# EAGLE design lab4 (EAGLE 9.6.2)
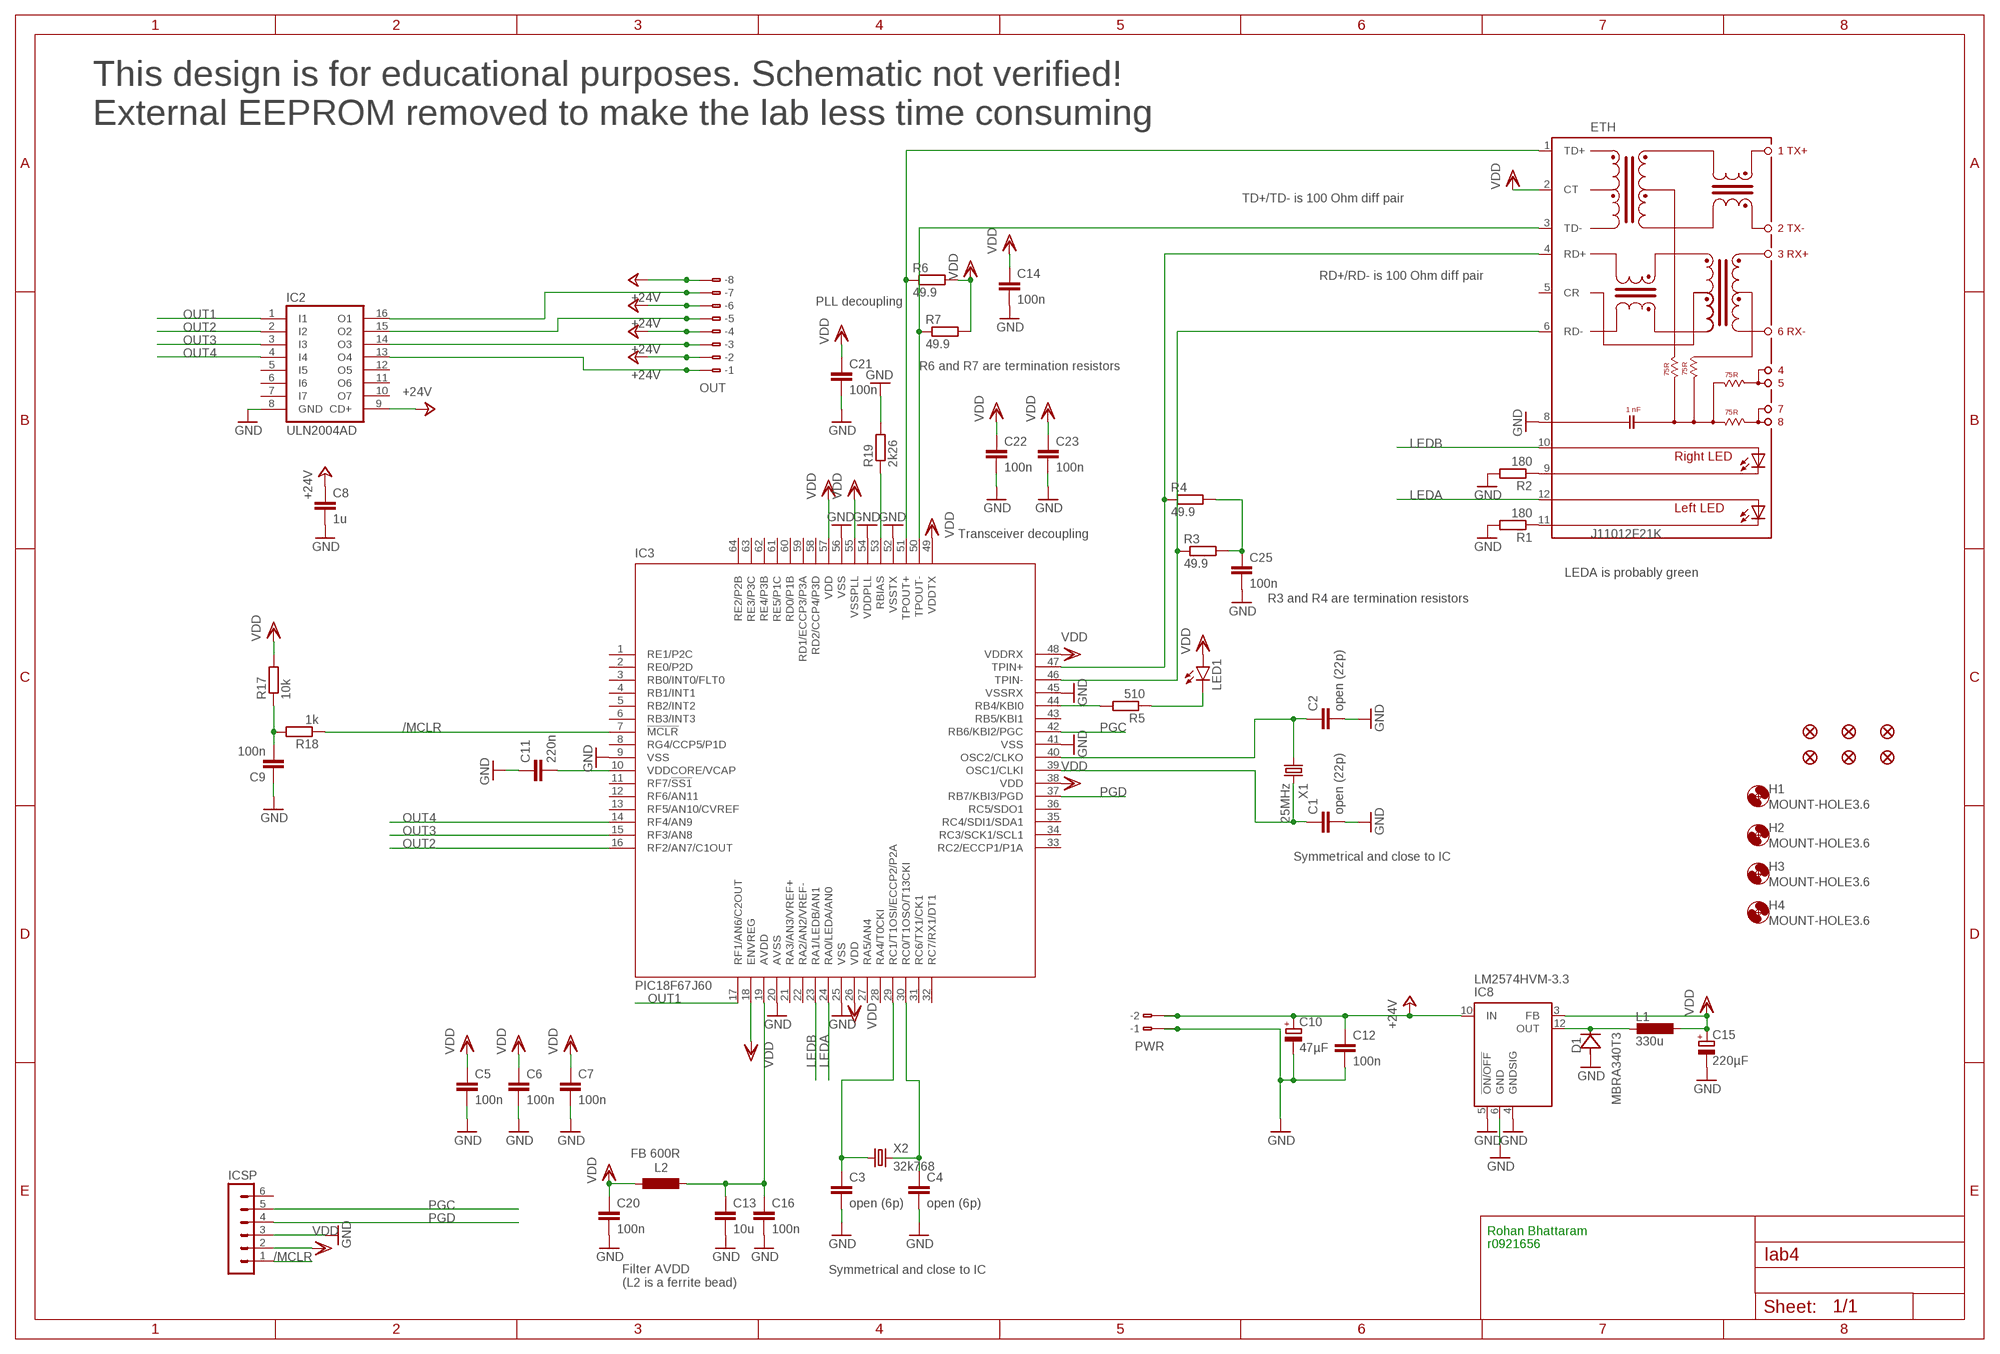
[diagram p0: schematic, sheet 1]

## Parts
C1  open (22p)  C-EUC0603  [C0603]
C2  open (22p)  C-EUC0603  [C0603]
C3  open (6p)  C-EUC0603  [C0603]
C4  open (6p)  C-EUC0603  [C0603]
C5  100n  C-EUC0603  [C0603]
C6  100n  C-EUC0603  [C0603]
C7  100n  C-EUC0603  [C0603]
C8  1u  C-EUC0603  [C0603]
C9  100n  C-EUC0603  [C0603]
C10  47µF  CPOL-EUE2.5-5  [E2,5-5]
C11  220n  C-EUC0603  [C0603]
C12  100n  C-EUC0603  [C0603]
C13  10u  C-EUC0805  [C0805]
C14  100n  C-EUC0603  [C0603]
C15  220µF  CPOL-EUE2.5-5  [E2,5-5]
C16  100n  C-EUC0603  [C0603]
C20  100n  C-EUC0603  [C0603]
C21  100n  C-EUC0603  [C0603]
C22  100n  C-EUC0603  [C0603]
C23  100n  C-EUC0603  [C0603]
C25  100n  C-EUC0603  [C0603]
D1  MBRA340T3  [SMA]
ETH  J11012F21K  [J1]
FID1  FIDUCIAL""  [FIDUCIAL_1MM]
FID2  FIDUCIAL""  [FIDUCIAL_1MM]
FID3  FIDUCIAL""  [FIDUCIAL_1MM]
FID4  FIDUCIAL""  [FIDUCIAL_1MM]
FID5  FIDUCIAL""  [FIDUCIAL_1MM]
FID6  FIDUCIAL""  [FIDUCIAL_1MM]
H1  MOUNT-HOLE3.6  [3,6]
H2  MOUNT-HOLE3.6  [3,6]
H3  MOUNT-HOLE3.6  [3,6]
H4  MOUNT-HOLE3.6  [3,6]
IC2  ULN2004AD  [SO16]
IC3  PIC18F67J60  [TQFP64-10X10]
IC8  LM2574HVM-3.3  [SO14W]
ICSP  MA06-1  [MA06-1]
L1  330u  SRN8040TA  [SRN8040TA]
L2  FB 600R  L-EUL0603  [RESC1608X80N]
LED1  LEDCHIP-LED0805  [CHIP-LED0805]
OUT  233-108  [233-108]
PWR  233-102  [233-102]
R1  180  R-EU_R0603  [R0603]
R2  180  R-EU_R0603  [R0603]
R3  49.9  R-EU_R0603  [R0603]
R4  49.9  R-EU_R0603  [R0603]
R5  510  R-EU_R0603  [R0603]
R6  49.9  R-EU_R0603  [R0603]
R7  49.9  R-EU_R0603  [R0603]
R17  10k  R-EU_R0603  [R0603]
R18  1k  R-EU_R0603  [R0603]
R19  2k26  R-EU_R0603  [R0603]
X1  25MHz  CRYSTALCTS406  [CTS406]
X2  32k768  CRYSTALTC26V  [TC26V]

## Nets
+24V: C8.1 C10.+ C12.1 IC2.9(CD+) IC8.10(IN) OUT.A2(-2) OUT.A4(-4) OUT.A6(-6) OUT.A8(-8) OUT.B2(B-2) OUT.B4(B-4) OUT.B6(B-6) OUT.B8(B-8) PWR.A2(-2) PWR.B2(B-2)
/MCLR: IC3.7(!MCLR) ICSP.1 R18.1
AVDD: C13.1 C16.1 IC3.19(AVDD) L2.1
GND: C1.2 C2.2 C3.2 C4.2 C5.2 C6.2 C7.2 C8.2 C9.1 C10.- C11.1 C12.2 C13.2 C14.2 C15.- C16.2 C20.2 C21.2 C22.2 C23.2 C25.2 D1.A ETH.8 IC2.8(GND) IC3.9(VSS) IC3.20(AVSS) IC3.25(VSS) IC3.41(VSS) IC3.45(VSSRX) IC3.52(VSSTX) IC3.54(VDDPLL) IC3.56(VSS) IC8.4(GNDSIG) IC8.5(!ON/OFF) IC8.6(GND) ICSP.3 PWR.A1(-1) PWR.B1(B-1) R1.2 R2.2 R19.2
LEDA: ETH.12(A-L) IC3.24(RA0/LEDA/AN0)
LEDB: ETH.10(A-R) IC3.23(RA1/LEDB/AN1)
N$2: C9.2 R17.1 R18.2
N$4: IC2.13(O4) OUT.A1(-1) OUT.B1(B-1)
N$5: IC3.53(RBIAS) R19.1
N$6: IC2.14(O3) OUT.A3(-3) OUT.B3(B-3)
N$7: C4.1 IC3.30(RC0/T1OSO/T13CKI) X2.2
N$10: IC2.15(O2) OUT.A5(-5) OUT.B5(B-5)
N$11: C3.1 IC3.29(RC1/T1OSI/ECCP2/P2A) X2.1
N$12: C1.1 IC3.39(OSC1/CLKI) X1.3
N$13: C2.1 IC3.40(OSC2/CLKO) X1.1
N$14: C11.2 IC3.10(VDDCORE/VCAP)
N$15: IC2.16(O1) OUT.A7(-7) OUT.B7(B-7)
N$17: ETH.11(C-L) R1.1
N$18: ETH.9(C-R) R2.1
N$19: C25.1 R3.2 R4.2
N$20: IC3.44(RB4/KBI0) R5.2
N$21: LED1.C R5.1
OUT1: IC2.1(I1) IC3.17(RF1/AN6/C2OUT)
OUT2: IC2.2(I2) IC3.16(RF2/AN7/C1OUT)
OUT3: IC2.3(I3) IC3.15(RF3/AN8)
OUT4: IC2.4(I4) IC3.14(RF4/AN9)
PGC: IC3.42(RB6/KBI2/PGC) ICSP.5
PGD: IC3.37(RB7/KBI3/PGD) ICSP.4
R1: ETH.4(RD+) IC3.47(TPIN+) R4.1
R2: ETH.6(RD-) IC3.46(TPIN-) R3.1
SW: D1.C IC8.12(OUT) L1.1
T1: ETH.1(TD+) IC3.51(TPOUT+) R6.1
T2: ETH.3(TD-) IC3.50(TPOUT-) R7.1
VDD: C5.1 C6.1 C7.1 C14.1 C15.+ C20.1 C21.1 C22.1 C23.1 ETH.2(CT) IC3.18(ENVREG) IC3.26(VDD) IC3.38(VDD) IC3.48(VDDRX) IC3.49(VDDTX) IC3.55(VSSPLL) IC3.57(VDD) IC8.3(FB) ICSP.2 L1.2 L2.2 LED1.A R6.2 R7.2 R17.2
Unconnected: ETH.5(CR) IC2.5(I5) IC2.6(I6) IC2.7(I7) IC2.10(O7) IC2.11(O6) IC2.12(O5) IC3.1(RE1/P2C) IC3.2(RE0/P2D) IC3.3(RB0/INT0/FLT0) IC3.4(RB1/INT1) IC3.5(RB2/INT2) IC3.6(RB3/INT3) IC3.8(RG4/CCP5/P1D) IC3.11(RF7/!SS1) IC3.12(RF6/AN11) IC3.13(RF5/AN10/CVREF) IC3.21(RA3/AN3/VREF+) IC3.22(RA2/AN2/VREF-) IC3.27(RA5/AN4) IC3.28(RA4/T0CKI) IC3.31(RC6/TX1/CK1) IC3.32(RC7/RX1/DT1) IC3.33(RC2/ECCP1/P1A) IC3.34(RC3/SCK1/SCL1) IC3.35(RC4/SDI1/SDA1) IC3.36(RC5/SDO1) IC3.43(RB5/KBI1) IC3.58(RD2/CCP4/P3D) IC3.59(RD1/ECCP3/P3A) IC3.60(RD0/P1B) IC3.61(RE5/P1C) IC3.62(RE4/P3B) IC3.63(RE3/P3C) IC3.64(RE2/P2B) ICSP.6

## Notes on the sheet
- This design is for educational purposes. Schematic not verified!
  External EEPROM removed to make the lab less time consuming
- TD+/TD- is 100 Ohm diff pair
- RD+/RD- is 100 Ohm diff pair
- PLL decoupling
- R6 and R7 are termination resistors
- Transceiver decoupling
- LEDA is probably green
- R3 and R4 are termination resistors
- Symmetrical and close to IC
- Rohan Bhattaram
- r0921656
- Symmetrical and close to IC
- Filter AVDD
  (L2 is a ferrite bead)

## Library data of the parts
C1-C9 C11 C12 C14 C16 C20-C23 C25 = ED:C-EU: CAPACITOR, European symbol; SPICEPREFIX: C
C10 C15 = rcl:CPOL-EU: POLARIZED CAPACITOR, European symbol; SPICEPREFIX: C
C13 = rcl:C-EU: CAPACITOR, European symbol; SPICEPREFIX: C
D1 = diode:MBRA340T3: Surface Mount Schottky Power Rectifier Source: http://www.onsemi.com/pub_link/Collateral/MBRA340T3-D.PDF
ETH = con-pulse:J11012F: PULSEJACK (TM) 1x1 Tab-UP RJ45 10/100 Base-TX RJ45 1x1 Tab-UP with LEDs 8-pin (J1 series) and 6-pin (JP series) integrated magnetics connector, designed to support applications, such as ADSL modems, LAN-on-Motherboard, and Hub and Switches. Source: www.pulseeng.com .. PulseJack-J402.pdf; OC_FARNELL: unknown; OC_NEWARK: unknown
FID1-FID6 = microbuilder:FIDUCIAL: Fiducial Alignment Points Various fiducial points for machine vision alignment.; BOM: EXCLUDE
H1-H4 = holes:MOUNT-HOLE: MOUNTING HOLE with drill center marker
IC2 = uln-udn:ULN2004A: DRIVER ARRAY
IC3 = microchip:PIC18F6*J6: PIC18F97J60 Family 64/80/100-Pin High-Performance, 1-Mbit Flash Microcontrollers with Ethernet Source: http://ww1.microchip.com/downloads/en/DeviceDoc/39762d.pdf; MPN: PIC18F67J60-I/PT; OC_FARNELL: 1332285; OC_NEWARK: 56K7302
IC8 = linear:LM2574?-*: SIMPLE SWITCHER 0.5A Step-Down Voltage Regulator Source: http://cache.national.com/ds/LM/LM2574.pdf
ICSP = con-lstb:MA06-1: PIN HEADER; OC_FARNELL: unknown; OC_NEWARK: unknown
L1 = ED:SRN8040TA: COILCRAFT; OC_FARNELL: 2616928; OC_NEWARK: unknown
L2 = ED:L-EU: INDUCTOR, European symbol
LED1 = led:LED: LED OSRAM: - CHIPLED LG R971, LG N971, LY N971, LG Q971, LY Q971, LO R971, LY R971 LH N974, LH R974 LS Q976, LO Q976, LY Q976 LO Q996 - Hyper CHIPLED LW Q18S LB Q993, LB Q99A, LB R99A - SideLED LS A670, LO A670, LY A670, LG A670, LP A670 LB A673, LV A673, LT A673, LW A673 LH A674 LY A675 LS A676, LA A676, LO A676, LY A676, LW A676 LS A679, LY A679, LG A679 - Hyper Micro SIDELED® LS Y876, LA Y876, LO Y876, LY Y876 LT Y87S - SmartLED LW L88C, LW L88S LB L89C, LB L89S, LG L890 LS L89K, LO L89K, LY L89K LS L896, LA L896, LO L896, LY L896 - TOPLED LS T670, LO T670, LY T670, LG T670, LP T670 LSG T670, LSP T670, LSY T670, LOP T670, LYG T670 LG T671, LOG T671, LSG T671 LB T673, LV T673, LT T673, LW T673 LH T674 LS T676, LA T676, LO T676, LY T676, LB T676, LH T676, LSB T676, LW T676 LB T67C, LV T67C, LT T67C, LS T67K, LO T67K, LY T67K, LW E67C LS E67B, LA E67B, LO E67B, LY E67B, LB E67C, LV E67C, LT E67C LW T67C LS T679, LY T679, LG T679 LS T770, LO T770, LY T770, LG T770, LP T770 LB T773, LV T773, LT T773, LW T773 LH T774 LS E675, LA E675, LY E675, LS T675 LS T776, LA T776, LO T776, LY T776, LB T776 LHGB T686 LT T68C, LB T68C - Hyper Mini TOPLED® LB M676 - Mini TOPLED Santana® LG M470 LS M47K, LO M47K, LY M47K Source: http://www.osram.convergy.de LUXEON: - LUMILED® LXK2-PW12-R00, LXK2-PW12-S00, LXK2-PW14-U00, LXK2-PW14-V00 LXK2-PM12-R00, LXK2-PM12-S00, LXK2-PM14-U00 LXK2-PE12-Q00, LXK2-PE12-R00, LXK2-PE12-S00, LXK2-PE14-T00, LXK2-PE14-U00 LXK2-PB12-K00, LXK2-PB12-L00, LXK2-PB12-M00, LXK2-PB14-N00, LXK2-PB14-P00, LXK2-PB14-Q00 LXK2-PR12-L00, LXK2-PR12-M00, LXK2-PR14-Q00, LXK2-PR14-R00 LXK2-PD12-Q00, LXK2-PD12-R00, LXK2-PD12-S00 LXK2-PH12-R00, LXK2-PH12-S00 LXK2-PL12-P00, LXK2-PL12-Q00, LXK2-PL12-R00 Source: www.luxeon.com KINGBRIGHT: KA-3528ASYC Source: www.kingbright.com
OUT = con-wago:233-108: WAGO Cage Clamp; MPN: 233-108; OC_FARNELL: unknown; OC_NEWARK: 28K9050
PWR = con-wago:233-102: WAGO Cage Clamp; MPN: 233-102; OC_FARNELL: unknown; OC_NEWARK: 28K9044
R1-R7 R17-R19 = ED:R-EU_: RESISTOR, European symbol; SPICEPREFIX: R
X1 X2 = crystal:CRYSTAL: CRYSTAL; OC_FARNELL: unknown; OC_NEWARK: unknown

## Net classes
1 PWR: width 0.203 mm, drill 0.381 mm, clearance 0.178 mm

## Board
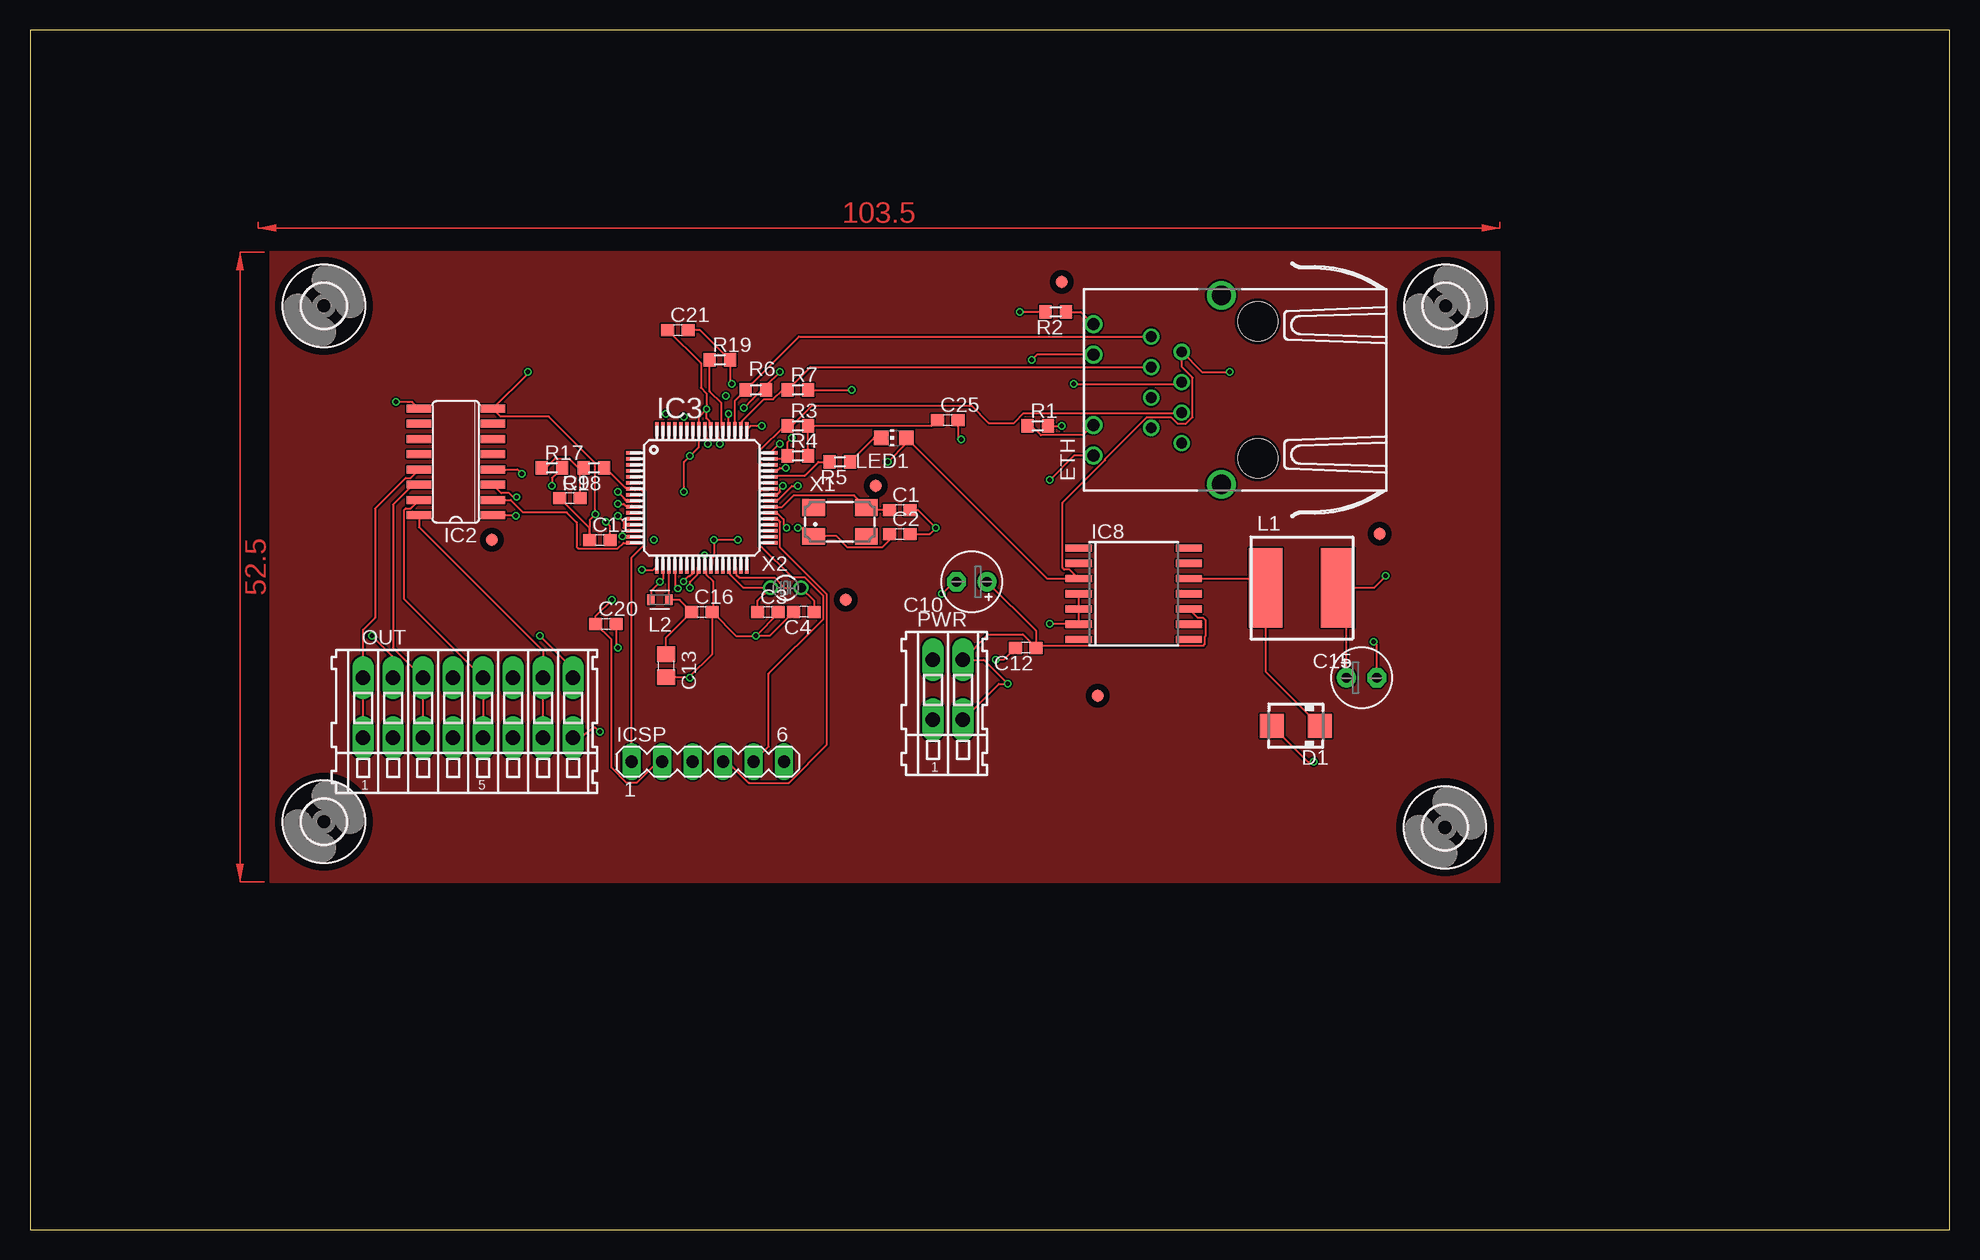
[diagram p1: board, top side]
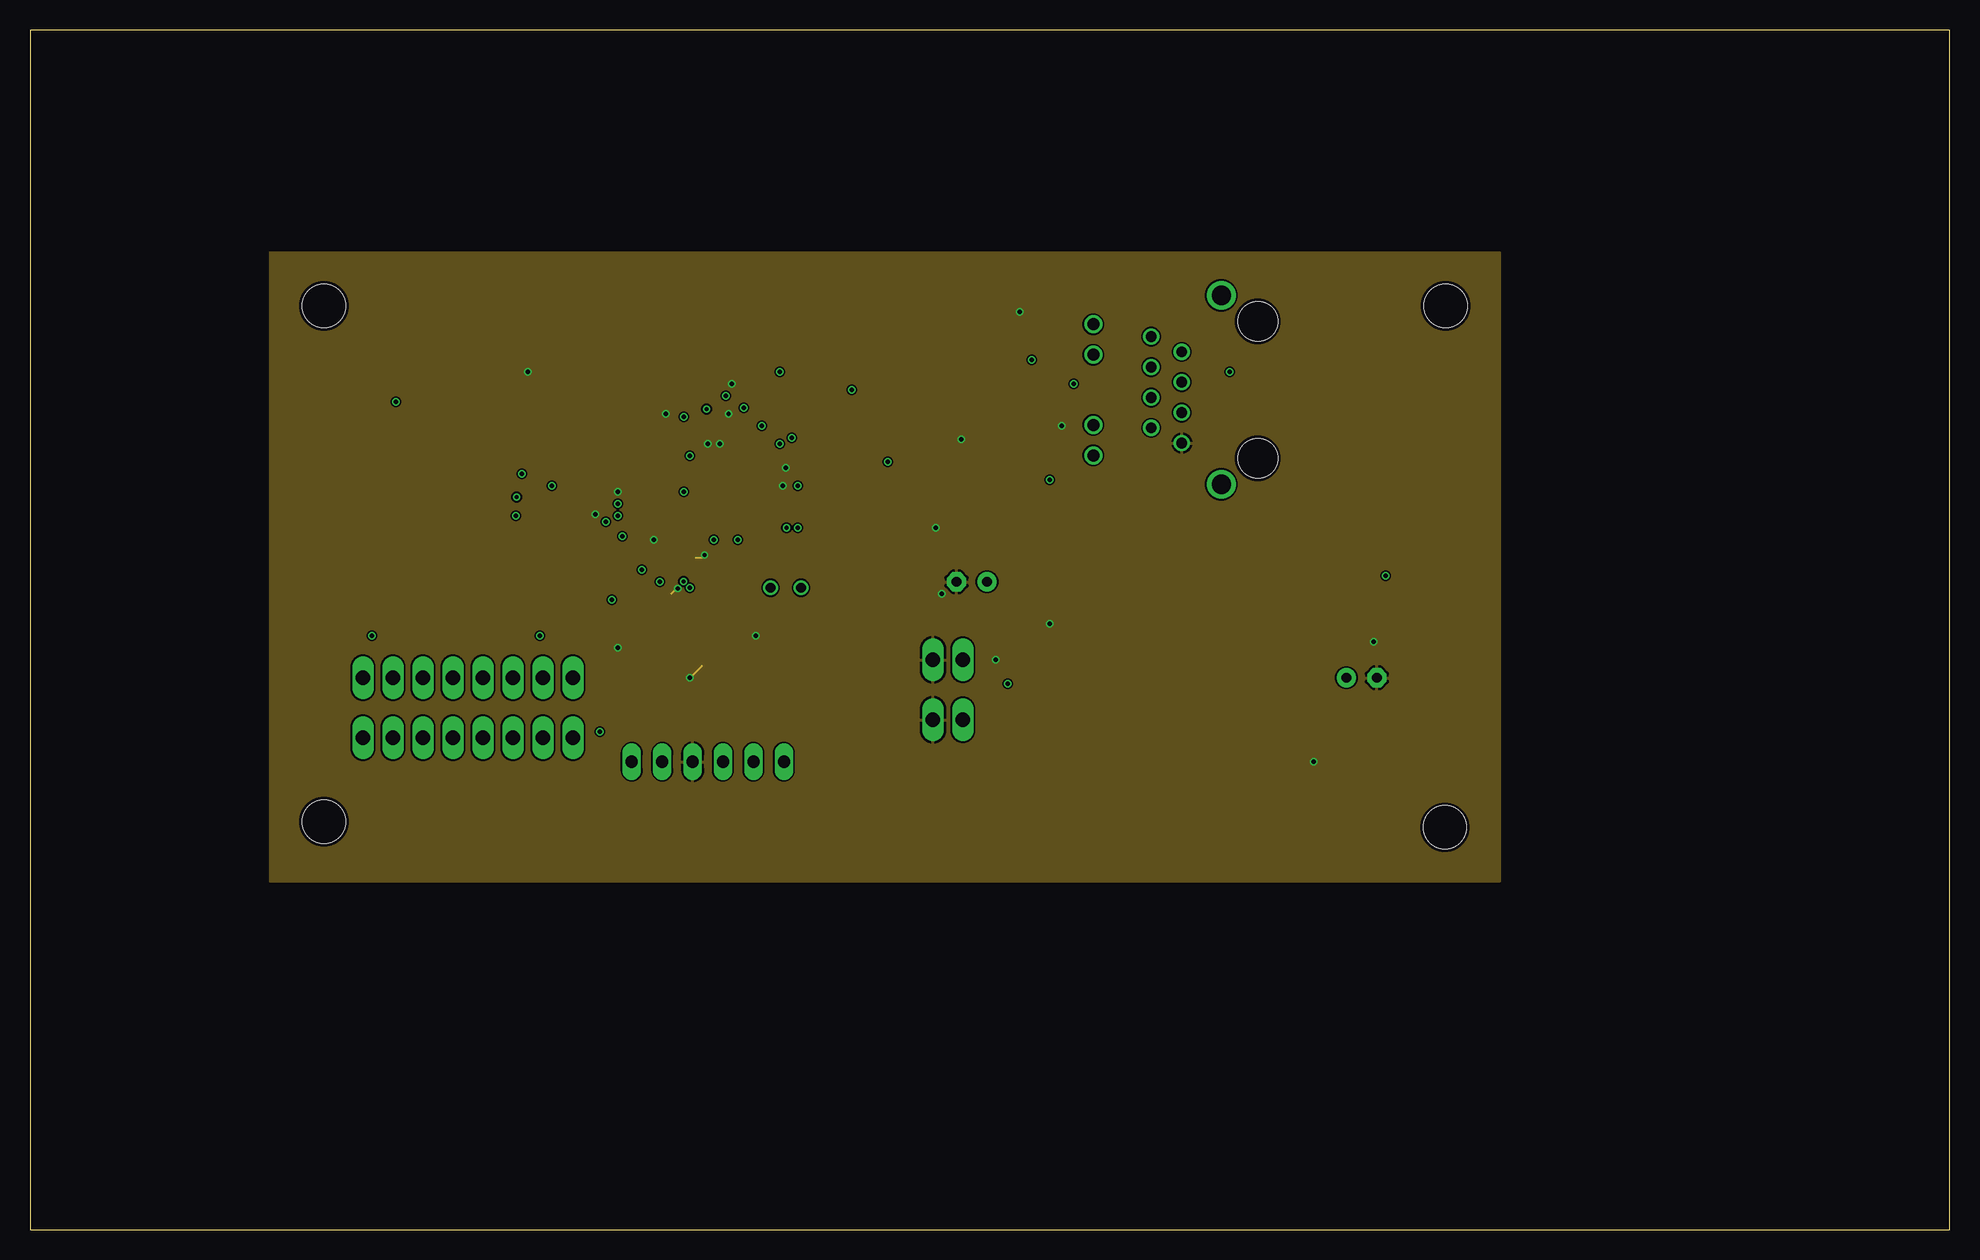
[diagram p2: board, inner layer Route2]
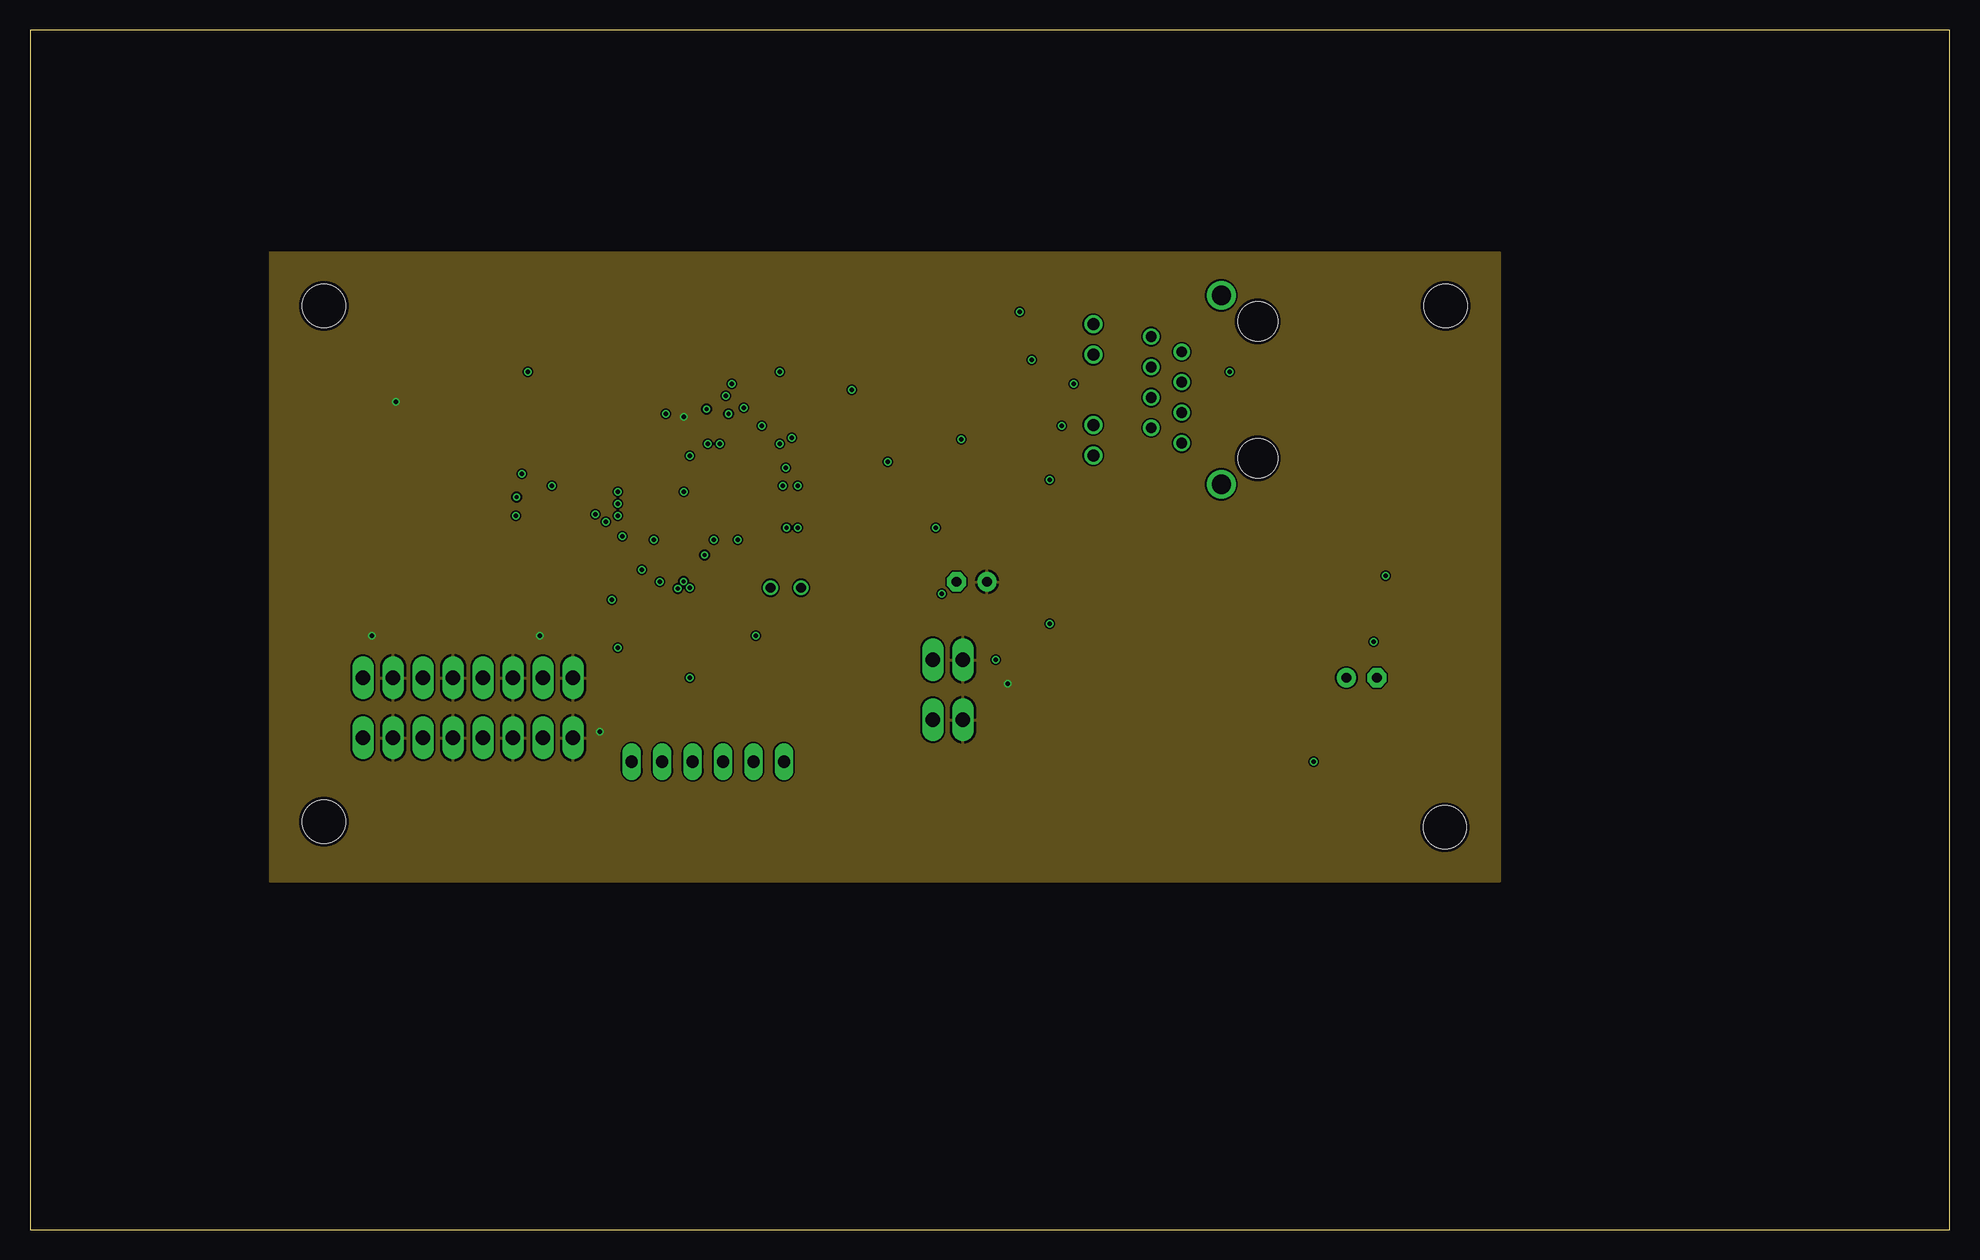
[diagram p3: board, inner layer Route15]
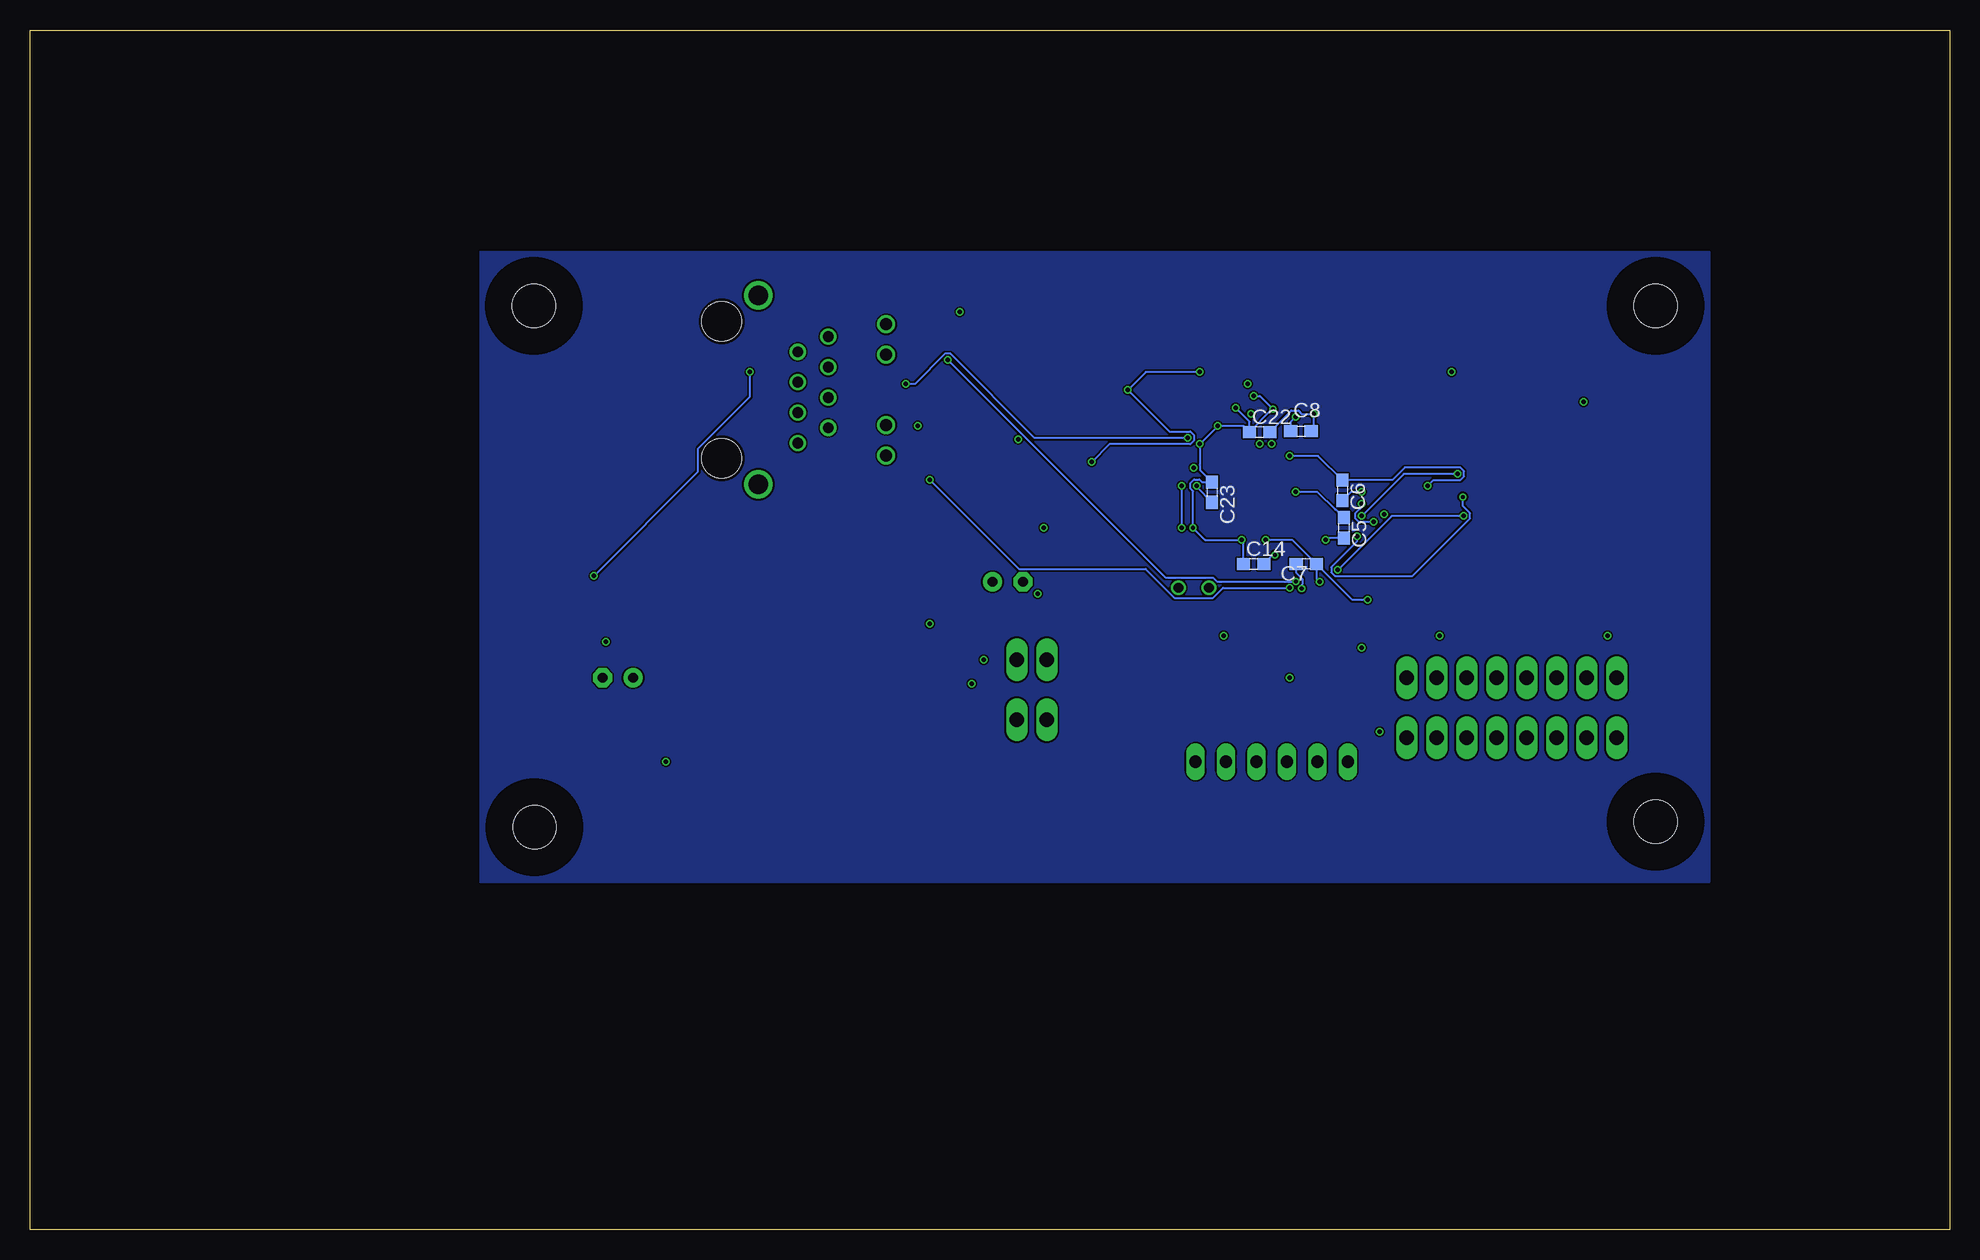
[diagram p4: board, bottom side, seen from below]

Size 160 x 100 mm. Coordinates in mm from the lower left corner, seen from the top.
Outline: 0,0 160,0 160,100 0,100 0,0
Copper layers (1+2*15+16): Top 0.018mm / dielectric 0.36mm / Route2 0.035mm / dielectric 0.71mm / Route15 0.035mm / dielectric 0.36mm / Bottom 0.018mm
Design rules "4Layer_PClass6 *": minimum track width 0.15mm, minimum drill 0.35mm, track to track 0.15mm, track to pad 0.15mm, pad to pad 0.15mm, via to via 0.15mm, smd to smd 0mil, copper to edge 0.25mm, drill to drill 0.35mm, minimum pad ring 0.175mm, minimum via ring 0.125mm, stop-mask expansion 0mil, vias tented up to drill 0.45mm, thermal gap 0.2mm

### Footprints (pad centres in the part's own frame; a part is rotated, then mirrored left to right if it is on the bottom)
C0603 = smd 1.1 x 1: 1 -0.85,0; 2 0.85,0
E2,5-5 = drill 0.813 pad 1.6: + -1.27,0 | drill 0.813 pad 1.6 octagon: - 1.27,0
C0805 = smd 1.3 x 1.5: 1 -0.95,0; 2 0.95,0
SMA = smd 2 x 2: A 2,0; C -2,0
J1 = drill 0.9 pad 1.3: 1 4.445,2.54; 2 3.175,0; 3 1.905,2.54; 4 0.635,0; 5 -0.635,2.54; 6 -1.905,0; 7 -3.175,2.54; 8 -4.445,0 | drill 1 pad 1.422: 9 5.465,7.37; 10 2.925,7.37; 11 -2.925,7.37; 12 -5.465,7.37 | drill 1.6 pad 2.184: M1 -7.875,-3.3; M2 7.875,-3.3 | hole 3.3: 5.715,-6.35; -5.715,-6.35
FIDUCIAL_1MM = smd 1 x 1: 1 0,0
3,6 = hole 3.6: 0,0
SO16 = smd 0.66 x 2.032: 1 -4.445,-3.073; 2 -3.175,-3.073; 3 -1.905,-3.073; 4 -0.635,-3.073; 5 0.635,-3.073; 6 1.905,-3.073; 7 3.175,-3.073; 8 4.445,-3.073; 9 4.445,3.073; 10 3.175,3.073; 11 1.905,3.073; 12 0.635,3.073; 13 -0.635,3.073; 14 -1.905,3.073; 15 -3.175,3.073; 16 -4.445,3.073
TQFP64-10X10 = smd 1.2 x 0.3: 1 -5.7,3.75; 2 -5.7,3.25; 3 -5.7,2.75; 4 -5.7,2.25; 5 -5.7,1.75; 6 -5.7,1.25; 7 -5.7,0.75; 8 -5.7,0.25; 9 -5.7,-0.25; 10 -5.7,-0.75; 11 -5.7,-1.25; 12 -5.7,-1.75; 13 -5.7,-2.25; 14 -5.7,-2.75; 15 -5.7,-3.25; 16 -5.7,-3.75; 33 5.7,-3.75; 34 5.7,-3.25; 35 5.7,-2.75; 36 5.7,-2.25; 37 5.7,-1.75; 38 5.7,-1.25; 39 5.7,-0.75; 40 5.7,-0.25; 41 5.7,0.25; 42 5.7,0.75; 43 5.7,1.25; 44 5.7,1.75; 45 5.7,2.25; 46 5.7,2.75; 47 5.7,3.25; 48 5.7,3.75 | smd 0.3 x 1.2: 17 -3.75,-5.7; 18 -3.25,-5.7; 19 -2.75,-5.7; 20 -2.25,-5.7; 21 -1.75,-5.7; 22 -1.25,-5.7; 23 -0.75,-5.7; 24 -0.25,-5.7; 25 0.25,-5.7; 26 0.75,-5.7; 27 1.25,-5.7; 28 1.75,-5.7; 29 2.25,-5.7; 30 2.75,-5.7; 31 3.25,-5.7; 32 3.75,-5.7; 49 3.75,5.7; 50 3.25,5.7; 51 2.75,5.7; 52 2.25,5.7; 53 1.75,5.7; 54 1.25,5.7; 55 0.75,5.7; 56 0.25,5.7; 57 -0.25,5.7; 58 -0.75,5.7; 59 -1.25,5.7; 60 -1.75,5.7; 61 -2.25,5.7; 62 -2.75,5.7; 63 -3.25,5.7; 64 -3.75,5.7
SO14W = smd 0.6 x 2.2: 1 -3.81,-4.6; 2 -2.54,-4.6; 3 -1.27,-4.6; 4 0,-4.6; 5 1.27,-4.6; 6 2.54,-4.6; 7 3.81,-4.6; 8 3.81,4.6; 9 2.54,4.6; 10 1.27,4.6; 11 0,4.6; 12 -1.27,4.6; 13 -2.54,4.6; 14 -3.81,4.6
MA06-1 = drill 1.016 long: 1 -6.35,0; 2 -3.81,0; 3 -1.27,0; 4 1.27,0; 5 3.81,0; 6 6.35,0
SRN8040TA = smd 2.8 x 6.6: 1 -3,0; 2 3,0
RESC1608X80N = smd 0.612 x 0.912: 1 -0.75,0; 2 0.75,0
CHIP-LED0805 = smd 1.2 x 1.2: A 0,-1.05; C 0,1.05
233-108 = drill 1.2 long: A1 -8.75,2.5; A2 -6.25,2.5; A3 -3.75,2.5; A4 -1.25,2.5; A5 1.25,2.5; A6 3.75,2.5; A7 6.25,2.5; A8 8.75,2.5; B1 -8.75,-2.5; B2 -6.25,-2.5; B3 -3.75,-2.5; B4 -1.25,-2.5; B5 1.25,-2.5; B6 3.75,-2.5; B7 6.25,-2.5; B8 8.75,-2.5
233-102 = drill 1.2 long: A1 -1.25,2.5; A2 1.25,2.5; B1 -1.25,-2.5; B2 1.25,-2.5
R0603 = smd 1 x 1.1: 1 -0.85,0; 2 0.85,0
CTS406 = smd 1.9 x 1.4: 1 -2.2,-1.2; 2 2.2,-1.2; 3 2.2,1.2; 4 -2.2,1.2
TC26V = drill 0.813: 1 -1.27,0; 2 1.27,0

### Placement (x,y rotation side)
C1  72.5,60 0 top
C2  72.5,58 0 top
C3  61.5,51.5 0 top
C4  64.5,51.5 180 top
C5  50.5,58.5 270 bottom
C6  50.61,61.63 270 bottom
C7  53.61,55.48 180 bottom
C8  54.06,66.55 0 bottom
C9  45,61 0 top
C10  78.5,54 180 top
C11  47.5,57.5 0 top
C12  83,48.5 180 top
C13  53,47 270 top
C14  58,55.5 0 bottom
C15  111,46 0 top
C16  56,51.5 0 top
C20  48,50.5 0 top
C21  54,75 0 top
C22  57.5,66.5 0 bottom
C23  61.48,61.47 270 bottom
C25  76.5,67.5 0 top
D1  105.5,42 180 top
ETH  96,70 90 top
FID1  70.5,62 0 top
FID2  68,52.5 0 top
FID3  38.5,57.5 0 top
FID4  89,44.5 0 top
FID5  86,79 0 top
FID6  112.5,58 90 top
H1  118,77 0 top
H2  24.5,77 0 top
H3  117.94,33.53 0 top
H4  24.5,34 0 top
IC2  35.5,64 90 top
IC3  56,61 0 top
IC8  92,53 270 top
ICSP  56.5,39 0 top
L1  106,53.5 0 top
L2  52.5,52.5 180 top
LED1  72,66 90 top
OUT  36.5,43.5 0 top
PWR  76.5,45 0 top
R1  84,67 0 top
R2  85.5,76.5 180 top
R3  64,67 0 top
R4  64,64.5 0 top
R5  67.5,64 180 top
R6  60.5,70 0 top
R7  64,70 0 top
R17  43.5,63.5 0 top
R18  47,63.5 180 top
R19  57.5,72.5 0 top
X1  67.5,59 0 top
X2  63,53.5 0 top

### Tracks (layer width: path | path; a pad name or v marks a point on that pad's centre or on a via)
+24V  (via drill 0.35)
  Top 0.152: C10.+ 83.85,49.92 C12.1 | C12.1 83.85,48.53 82.76,49.62 79.87,49.62 PWR.A2 79.5,47.5 v81.5,45.5 80.75,45.5 PWR.B2 | C12.1 84.01,48.66 97.79,48.66 97.93,48.8 97.93,49.43 98,49.5 98,50.78 97.79,50.99 97.34,50.99 IC8.10 | v28.5,49.5 30.25,47.75 OUT.A2 | v47.5,41.5 47.09,41.84 47,41.88 45.85,41 OUT.B8 | IC2.9 31.87,69 v30.5,69 | v42.5,49.5 45.25,46.75 OUT.A8
  Route15 0.152: v54.5,67.75 54.5,67.5
  Bottom 0.152: C8.1 54.91,67.34 v54.5,67.75
  pour Route15: 20,81.5 122.5,81.5 122.5,29 20,29
/MCLR
  Top 0.152: R18.1 47.98,63.5 49.61,61.87 50.18,61.87 IC3.7 50.42,61.63 50.99,61.63 51.13,61.49 51.13,57.01 50.15,56.03 ICSP.1
AVDD
  Top 0.152: C13.1 53,49.35 C16.1 54.15,52.5 L2.1 IC3.19
GND  (via drill 0.35)
  Top 0.152: v41.5,71.5 41.5,71.37 IC2.8 39.24,67.78 43.24,67.78 47.12,63.9 v47.12,59.62 46.65,59.15 C11.1 46.65,58.5 C9.1 | IC3.56 56.37,66.58 56.37,66.01 56.5,65.88 v56.5,65.5 | C20.2 48.85,48.65 v49,48.5 | C13.2 54.95,46.05 | 54.95,46.05 v55,46 | 54.95,46.05 56.85,47.95 C16.2 56.92,51.42 | 56.92,51.42 58.85,49.5 v60.5,49.5 | C3.2 62.35,51.35 v60.5,49.5 | C4.2 61.65,49.5 v60.5,49.5 | C1.2 74,60 v75.5,58.5 75,58 C2.2 | C25.2 77.35,65.88 v77.62,65.88 | R2.2 v82.5,76.5 | C12.2 81.15,47.5 v80.5,47.5 | C10.- 77,54 v76,53 | v85,50.5 85.04,50.46 IC8.6 IC8.5 IC8.4 | C21.2 55.85,75 R19.2 58.35,70.65 v58.5,70.5 | D1.A 106.5,39 v107,39 | C15.- 112.27,48.73 v112,49 | IC3.52 58.22,66.73 v58.22,68 | IC3.54 57.37,66.58 57.37,66.01 57.5,65.88 v57.5,65.5 | IC3.45 61.82,63.37 62.39,63.37 62.52,63.5 v63,63.5 | 56.92,51.42 56.92,54.05 56.37,54.61 56.37,55.18 IC3.25 56.22,55.33 v56.22,56.22 | IC3.20 53.75,53.43 v54.01,53.43 | IC3.41 61.82,61.37 62.39,61.37 62.53,61.51 62.53,61.78 v62.75,62 | R1.2 v86,67 | v49,61.5 49.47,61.03 49.47,61.01 49.73,60.75 IC3.9
  Route2 0.152: v55,46 56,47 | v77.62,65.88 77.62,66.12 | v58.22,68 58.5,68 | v54.01,53.43 53.88,53.43 53.44,53 | v62.75,62 62.5,62 | v56.22,56.22 56,56 55.5,56
  Bottom 0.152: C8.2 53,66.76 v53,68 54.01,68 54.28,68.28 54.87,68.28 C22.2 | C23.2 62.75,61.89 v62.75,62 | C14.2 56.22,56.43 v56.22,56.22 | C7.2 54.46,54.77 53.94,54.25 53.94,53.81 54.01,53.75 v54.01,53.43 | C5.2 51.85,57.65 v52,57.5 | v49,61.5 49.89,61.5 C6.2
  pour Route2: 20,81.5 122.5,81.5 122.5,29 20,29
IC8
  pour Top (rank 2): 85.5,47 85.5,59.5 106.5,59.5 106.5,47.5 106.5,46.5 85.5,46.5
LEDA  (via drill 0.35)
  Top 0.152: ETH.12 87.03,64.53 v85,62.5 | IC3.24 55.63,55.18 55.63,54.61 55,53.98 v55,53.5
  Bottom 0.152: v85,62.5 77.57,55.07 67.02,55.07 64.62,52.66 61.38,52.66 60.55,53.5 v55,53.5
LEDB  (via drill 0.35)
  Top 0.152: ETH.10 83.92,72.92 v83.5,72.5 | v54.47,54.03 54.91,54.47 54.99,54.47 55.25,54.73 IC3.23
  Bottom 0.152: v54.47,54.03 61.08,54.03 61.38,54.34 65.34,54.34 v83.5,72.5
N$2
  Top 0.152: C9.2 45.85,63.2 R18.2 45.72,63.5 44.94,64.28 43.76,64.28 42.98,63.5 R17.1
N$4
  Top 0.152: IC2.13 31.71,62.65 31.32,62.65 28.75,60.08 28.75,51 27.75,50 OUT.A1 OUT.B1
N$5
  Top 0.152: IC3.53 57.63,66.82 57.63,68.89 56.65,69.87 R19.1
N$6
  Top 0.152: IC2.14 31.93,62.09 30.25,60.42 30.25,48.5 OUT.A3 OUT.B3
N$7
  Top 0.152: C4.1 65.35,52.42 X2.2 62.91,53.5 62.08,54.34 59.14,54.34 58.87,54.61 58.87,55.18 IC3.30
N$10
  Top 0.152: IC2.15 31.71,60.11 31.32,60.11 31.18,59.98 31.18,52.57 OUT.A5 OUT.B5
N$11
  Top 0.152: C3.1 60.65,52.42 X2.1 59.48,53.5 58.37,54.61 58.37,55.18 IC3.29
N$12
  Top 0.152: C1.1 69.9,60 X1.3 68.7,61.2 63.65,61.2 62.7,60.25 IC3.39
N$13  (via drill 0.35)
  Top 0.152: C2.1 71.65,57.5 71.02,56.87 68.16,56.87 67.23,57.8 X1.1 64.6,58.5 v64,58.5 | IC3.40 61.82,60.87 62.39,60.87 63.52,62 v64,62
  Bottom 0.152: v64,58.5 v64,62
N$14  (via drill 0.35)
  Top 0.152: C11.2 48.35,58.65 v48,59 | v49,60.5 49.48,60.5 49.61,60.37 50.18,60.37 IC3.10
  Bottom 0.152: v48,59 48.76,59 48.78,58.97 49.22,58.97 49.53,59.28 49.53,59.72 49,60.24 v49,60.5
N$15
  Top 0.152: IC2.16 32.43,58.55 42.75,48.23 OUT.A7 OUT.B7
N$17
  Top 0.152: R1.1 83.48,67 84.26,66.22 87.78,66.22 ETH.11
N$18
  Top 0.152: R2.1 87.59,76.5 ETH.9
N$19
  Top 0.152: R4.2 R3.2 75.15,67 C25.1
N$20
  Top 0.152: IC3.44 61.82,62.87 64.59,62.87 65.72,64 R5.2
N$21
  Top 0.152: R5.1 70.35,66 LED1.C
OUT1  (via drill 0.35)
  Top 0.152: IC2.1 40.45,59.55 v40.5,59.5 | v51,55 51.95,55 IC3.17
  Bottom 0.152: v40.5,59.5 46.5,59.5 v51,55
OUT2
  Top 0.152: IC2.2 40.07,60.83 41.12,59.77 44.75,59.77 45.57,58.95 45.57,56.91 45.71,56.77 48.99,56.77 49.47,57.25 IC3.16
OUT3  (via drill 0.35)
  Top 0.152: IC3.15 49.41,57.75 v49.38,57.78 | v40.57,61.07 40.26,61.07 39.95,61.38 39.29,61.38 IC2.3
  Bottom 0.152: v49.38,57.78 49.38,57.37 51.53,55.22 51.53,54.78 51.22,54.47 44.78,54.47 39.97,59.28 39.97,59.72 40.57,60.31 v40.57,61.07
OUT4  (via drill 0.35)
  Top 0.152: IC2.4 40.63,63.37 v41,63 | v49,59.5 49.47,59.03 49.47,58.51 49.73,58.25 IC3.14
  Bottom 0.152: v41,63 45.5,63 v49,59.5
PGC
  Top 0.152: IC3.42 61.58,61.63 61.01,61.63 60.87,61.49 60.87,57.01 63.54,54.34 64.62,54.34 66.13,52.83 66.13,50.91 61.57,46.35 61.57,40.26 ICSP.5
PGD
  Top 0.152: IC3.37 61.82,59.13 62.39,59.13 62.53,58.99 62.53,56.85 66.43,52.95 66.43,40.42 63.26,37.25 59.9,37.25 58.15,39 ICSP.4
R1  (via drill 0.35)
  Top 0.152: IC3.47 62.9,64.25 R4.1 63.15,65.65 v63.5,66 | v87,70.5 95.86,70.5 ETH.4
  Bottom 0.152: v63.5,66 76.26,66 83.28,73.03 83.72,73.03 86.24,70.5 v87,70.5
R2
  Top 0.152: IC3.46 61.58,63.87 61.01,63.87 60.87,64.01 60.87,64.99 62.88,67 R3.1 63.48,67 65.18,68.7 78.46,68.7 79.92,67.24 82.02,67.24 82.83,68.05 95.96,68.05 ETH.6
SIGNAL_BOTTOM
  pour Bottom: 20,81.5 122.5,81.5 122.5,29 20,29
SIGNAL_TOP
  pour Top: 20,29 122.5,29 122.5,81.5 20,81.5
SW
  Top 0.152: D1.C 103,46.5 L1.1 102.23,54.27 IC8.12
T1
  Top 0.152: IC3.51 58.75,69.1 R6.1 64.09,74.44 ETH.1
T2
  Top 0.152: IC3.50 59.37,66.82 59.37,67.39 61.2,69.22 61.94,69.22 62.72,70 R7.1 65.06,71.91 ETH.3
VDD  (via drill 0.35)
  Top 0.152: v54.5,61.5 54.5,64 v55,64.5 55.75,65.25 IC3.57 55.75,67.75 v56.39,68.39 | IC3.26 56.87,55.42 56.87,55.99 57,56.12 v57,57.5 v59,57.5 | R17.2 43.5,62.65 v43.5,62 | v48.5,52.5 47.15,51.15 C20.1 48.47,49.18 48.47,38.52 49.74,37.25 50.56,37.25 52.31,39 ICSP.2 | R7.2 v68.5,70 | v71.5,64 73.05,65.55 LED1.A 84.78,54.27 IC8.3 86.66,55.01 86.21,55.01 86.07,55.15 86.07,60.6 89.61,64.13 89.61,64.25 93.09,67.73 95.09,67.73 95.63,67.19 96.37,67.19 96.9,67.72 96.9,71.01 96,71.91 ETH.2 97.67,71.5 v100,71.5 | v59.5,68.5 60.22,69.22 60.24,69.22 61.02,70 R6.2 61.35,70.35 v62.5,71.5 | IC3.55 56.63,66.82 56.63,67.39 56.39,67.63 v56.39,68.39 | IC3.48 62.45,65.5 v62.5,65.5 | v61,67 60.05,67 IC3.49 | v63.05,58.5 62.83,58.72 62.83,59.19 62.27,59.75 IC3.38 | C21.1 55.92,72.23 55.92,70.17 56.39,69.7 v56.39,68.39 | L2.2 51.75,53.25 v52.5,54 52.75,54.25 IC3.18 | C15.+ 109.73,52.77 L1.2 112,53.5 v113,54.5
  Bottom 0.152: v55,64.5 52.63,64.5 C6.1 46.45,62.48 45.4,63.53 40.78,63.53 40.47,63.22 40.47,62.78 40.78,62.47 43.03,62.47 v43.5,62 | C5.1 51.15,60 51.2,60 52.7,61.5 v54.5,61.5 | C7.1 54.78,57.5 v57,57.5 | C14.1 58.85,57.35 v59,57.5 62.05,57.5 v63.05,58.5 63.05,61.56 63.28,61.78 63.28,62.22 62.97,62.53 62.53,62.53 62.33,62.32 61.5,62.32 | v48.5,52.5 49.78,52.5 C7.1 | v71.5,64 70.03,65.47 63.28,65.47 62.97,65.78 62.97,66.22 63.28,66.53 65.03,66.53 v68.5,70 67,71.5 v62.5,71.5 | v113,54.5 104.33,63.17 104.33,65.1 100,69.43 v100,71.5 | C22.1 58.35,67.35 v59.5,68.5 | v58,69.5 57.5,69.5 v56.39,68.39 56.46,68.39 C22.1 | C22.1 58.85,67 v61,67 v62.5,65.5 62.5,63.74 62.47,63.72 62.47,63.29 61.5,62.32 | 61.5,62.32 C23.1 | C7.1 52.76,54.26 v52.5,54
(copper drawn outside any net)
  shapes: Top area x2

### Text on the board
Document: 1 | Layer 1: / Copper: 0.018 mm / Prepreg: 0.36 mm / Layer 2: / Copper: 0.035 mm / Core: 0.71 mm / Layer 15: / Copper: 0.035 mm / Prepreg: 0.36 mm / Layer 16: / Copper: 0.018 mm